# Altium project lora1262f30.PrjPcb
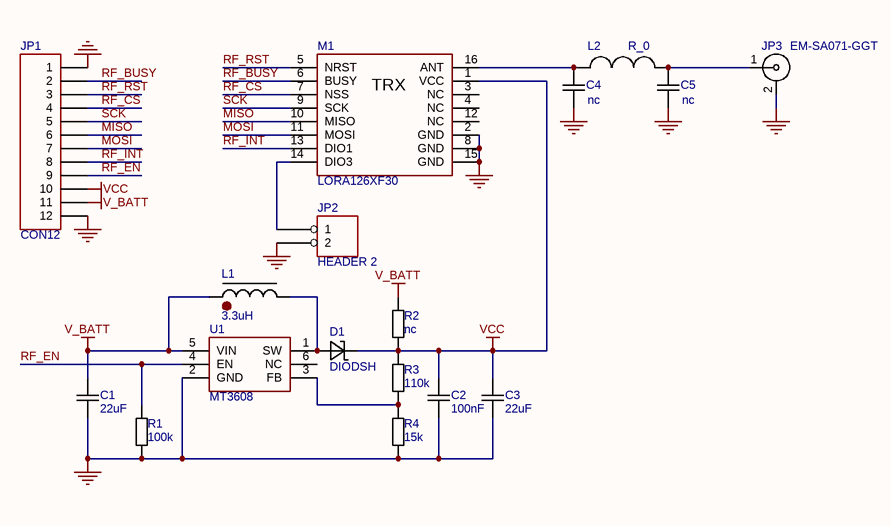
[diagram p0: lora1262f30m.SchDoc]
1 sheet, 17 parts. Net scope: global (net labels, ports and power ports of the same name join across sheets).
Board file: lora1262f30m.PcbDoc

## Sheet lora1262f30m.SchDoc
size A4; SheetNumber: 1; SheetTotal: 1

### Parts
C1  22uF  [C-0805]
C2  100nF  [C-0603]
C3  22uF  [C-0805]
C4  nc  [C-0603]
C5  nc  [C-0603]
D1  DIODSH  [D_SMA_NUM]
JP1  CON12  [PBS1-12R]
JP2  HEADER 2  [PLS1-2]
JP3  EM-SA071-GGT  [SMA_F_EDGE]
L1  3.3uH  [CDRH6D38]
L2  R_0  [L-0603]
M1  LORA126XF30  [LGA16_LORA126XF30]
R1  100k  [R-0603]
R2  nc  [R-1206]
R3  110k  [R-0603]
R4  15k  [R-0603]
U1  MT3608  [SOT-23-6]

### Nets
GND: C1.2 C2.2 C3.2 C4.2 C5.2 JP1.1 JP1.12 JP2.2 JP3.2 M1.2(GND) M1.8(GND) M1.15(GND) R1.1 R4.1 U1.2(GND)
V_BATT: C1.1 JP1.11 L1.1 R2.2 U1.5(VIN)
VCC: C2.1 C3.1 D1.2 JP1.10 M1.1(VCC) R2.1 R3.2
MISO: JP1.6 M1.10(MISO)
MOSI: JP1.7 M1.11(MOSI)
RF_BUSY: JP1.2 M1.6(BUSY)
RF_CS: JP1.4 M1.7(NSS)
RF_EN: JP1.9 R1.2 U1.4(EN)
RF_INT: JP1.8 M1.13(DIO1)
RF_RST: JP1.3 M1.5(NRST)
SCK: JP1.5 M1.9(SCK)
NetC4_1: C4.1 L2.1 M1.16(ANT)
NetC5_1: C5.1 JP3.1 L2.2
NetD1_1: D1.1 L1.2 U1.1(SW)
NetJP2_1: JP2.1 M1.14(DIO3)
NetR3_1: R3.1 R4.2 U1.3(FB)

Not connected (* = marked no-connect by the designer): M1 3(NC) 4(NC) 12(NC); U1 6(NC)

### Notes on the sheet
- (in symbol LORA126XF30) TRX

### Library data of the parts
C1-C5 = CAPN: Voltage: 50V; Точність/група: NP0; Вид: Конденсатор
D1 = DIODSH: Вид: Діод
JP1 = CON12: Connector; Вид: Роз'єм; *: *
JP2 = HEADER 2: Вид: Роз'єм; *: *
JP3 = SMA: SMA Female R/A PCB Mount; Вид: Роз'єм
L1 = L*: Вид: Індуктивність
L2 = L: Вид: Індуктивність
R1-R4 = RES: Точність/група: 5%; Вид: Резистор